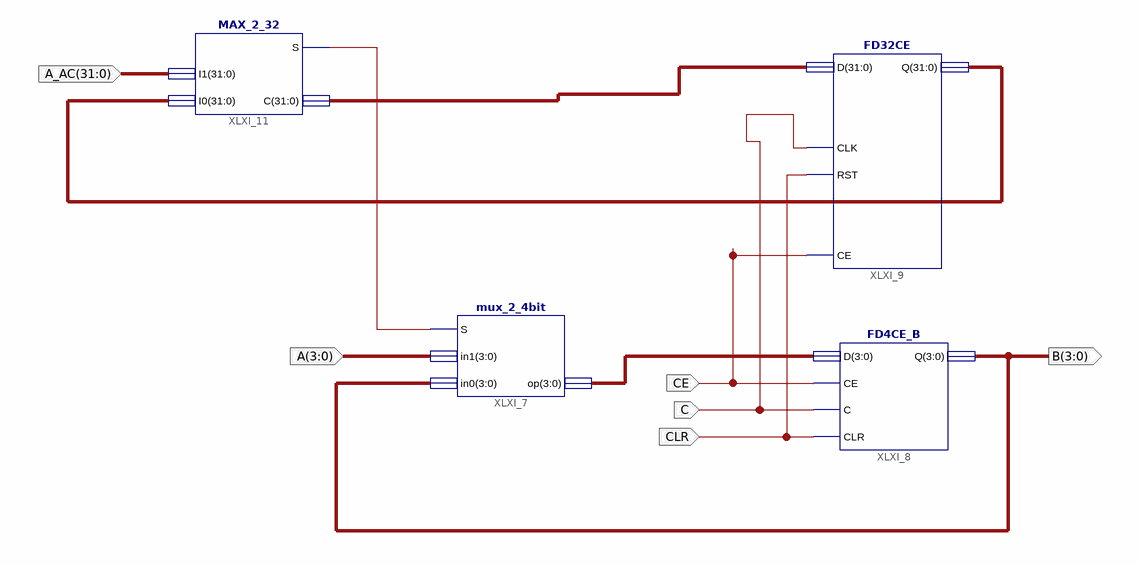
[diagram p0: schematic sheet 1]
// Xilinx ISE schematic Max_at_num.sch (spartan3e) as structural Verilog: 4 symbols, 6 ports
module Max_at_num (
  input  [3:0] A,
  input  CE,
  input  C,
  input  CLR,
  input  [31:0] A_AC,
  output [3:0] B
);

  wire XLXN_24;
  wire [3:0] XLXN_18;
  wire [31:0] XLXN_17, XLXN_19;

  FD4CE_B XLXI_8 (.D(XLXN_18), .CE(CE), .C(C), .CLR(CLR), .Q(B));
  mux_2_4bit XLXI_7 (.in0(B), .in1(A), .S(XLXN_24), .op(XLXN_18));
  FD32CE XLXI_9 (.CLK(C), .RST(CLR), .D(XLXN_19), .Q(XLXN_17), .CE(CE));
  MAX_2_32 XLXI_11 (.I0(XLXN_17), .I1(A_AC), .S(XLXN_24), .C(XLXN_19));
endmodule
